# Altium schematic sheet USB_PowerOnly.SchDoc
size A2; SheetNumber: 2; SheetTotal: 14
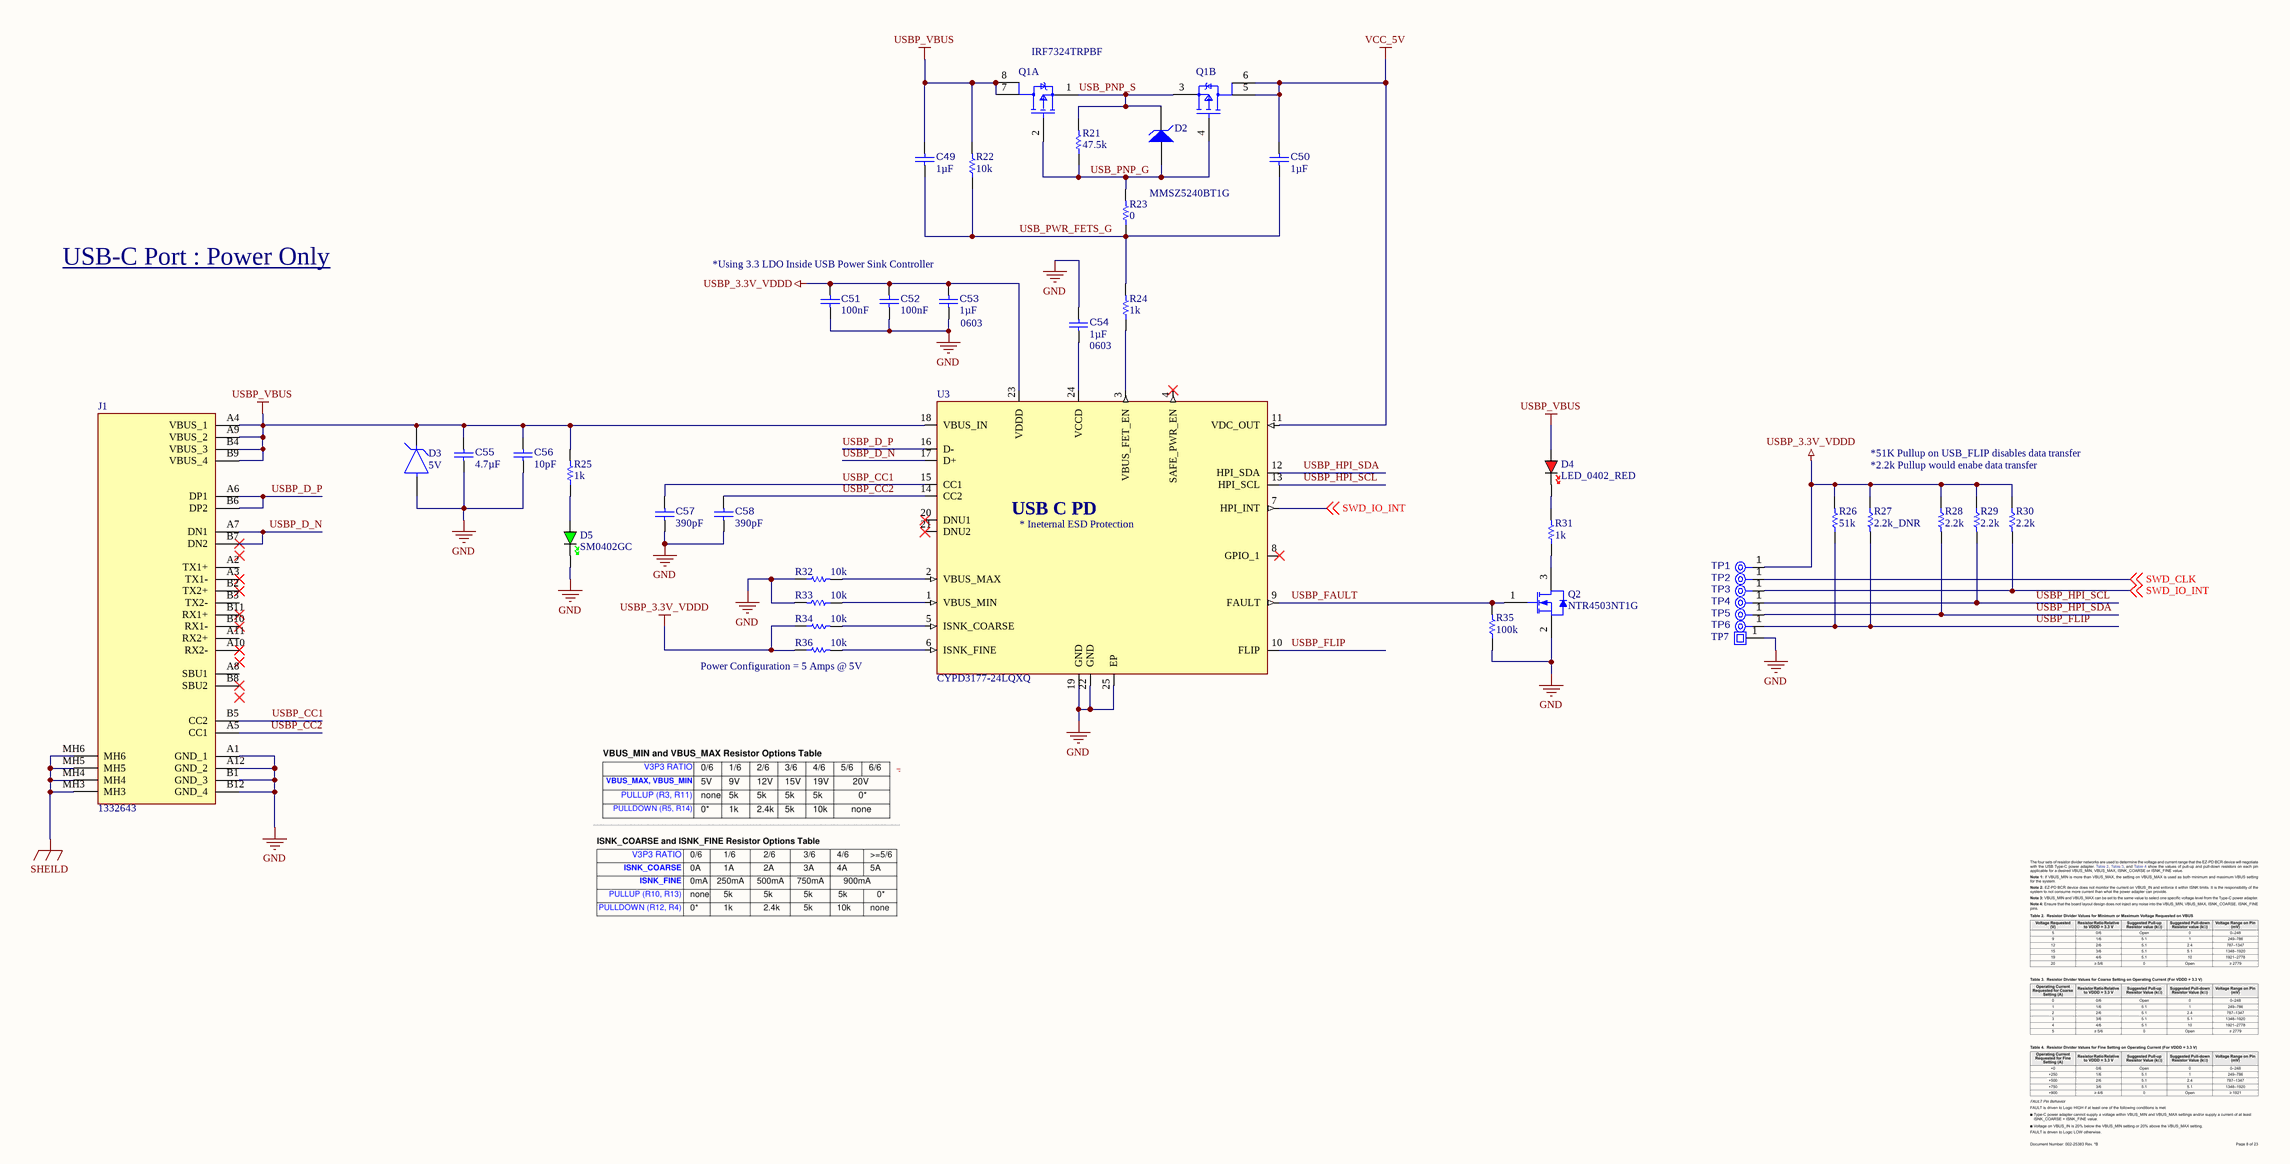
[diagram p0: USB_PowerOnly.SchDoc]

## Parts
C49  value 1µF  [CAPC2013X135X45NL10T25]  (hidden comment: Capacitor 1 uF +/- 10% 50 V 0805)
C50  value 1µF  [CAPC2013X135X45NL10T25]  (hidden comment: Capacitor 1 uF +/- 10% 50 V 0805)
C51  value 100nF  [CAPC2013X145X48ML20T23]  (hidden comment: VJ0805Y104JXXAT)
C52  value 100nF  [CAPC2013X145X48ML20T23]  (hidden comment: VJ0805Y104JXXAT)
C53  value 1µF  Case/Package: 0603  [CAPC1608X90X35LL15T15]  (hidden comment: 0603YC105JAT2A)
C54  value 1µF  Case/Package: 0603  [CAPC1608X90X35LL15T15]  (hidden comment: 0603YC105JAT2A)
C55  value 4.7µF  [CAPC0805(2012)145_L]  (hidden comment: Capacitor 4.7µF +/-40% 25V 0805)
C56  value 10pF  [CAPC1005X55X25ML05T05]  (hidden comment: Capacitor 10 pF +/- 5% 50 V 0402)
C57  value 390pF  [FP-C0402-BB-MFG]  (hidden comment: C0402C391K4RACTU)
C58  value 390pF  [FP-C0402-BB-MFG]  (hidden comment: C0402C391K4RACTU)
D2  MMSZ5240BT1G  [ONSC-SOD-123-2-425-04_V]
D3  Reverse Standoff Voltage: 5V  [FP-SMA-MFG]  (hidden comment: SMAJ5.0A-13-F)
D4  LED_0402_RED  [LED_0402_RED]
D5  SM0402GC  [FP-SM0402GC-MFG]
J1  1332643  [1332643]
Q1  IRF7324TRPBF  [FP-PG-DSO-8-IPC_B]  (parts A,B of 2)
Q2  NTR4503NT1G  [ONSC-SOT-23-3-318-08_V]
R21  value 47.5k  [RESC0402(1005)_L]  (hidden comment: Resistor 47K5 +/-1 % 0402 63 mW)
R22  value 10k  [RESC1005X40X25ML05T05]  (hidden comment: Resistor 10k +/-1% 0402 100 mW)
R23  value 0  [RESC1005X40X25ML05T05]  (hidden comment: Resistor 0R +/- 5% 0402 100 mW)
R24  value 1k  [RESC0402(1005)_L]  (hidden comment: Resistor 1K +/-5 % 0402 63 mW)
R25  value 1k  [RESC0402(1005)_L]  (hidden comment: Resistor 1K +/-5 % 0402 63 mW)
R26  value 51k  [RESC1005X40X25ML05T10]  (hidden comment: Resistor 51k +/-5% 0402 63 mW)
R27  value 2.2k_DNR  [RESC0402(1005)_L]  (hidden comment: Resistor 2K2  +/-5 % 0402 63 mW)
R28  value 2.2k  [RESC0402(1005)_L]  (hidden comment: Resistor 2K2  +/-5 % 0402 63 mW)
R29  value 2.2k  [RESC0402(1005)_L]  (hidden comment: Resistor 2K2  +/-5 % 0402 63 mW)
R30  value 2.2k  [RESC0402(1005)_L]  (hidden comment: Resistor 2K2  +/-5 % 0402 63 mW)
R31  value 1k  [RESC0402(1005)_L]  (hidden comment: Resistor 1K +/-5 % 0402 63 mW)
R32  value 10k  [RESC1005X40X25ML05T05]  (hidden comment: Resistor 10k +/-1% 0402 100 mW)
R33  value 10k  [RESC1005X40X25ML05T05]  (hidden comment: Resistor 10k +/-1% 0402 100 mW)
R34  value 10k  [RESC1005X40X25ML05T05]  (hidden comment: Resistor 10k +/-1% 0402 100 mW)
R35  value 100k  [RESC1005X40X25ML05T05]  (hidden comment: Resistor 100k +/-1% 0402 63 mW)
R36  value 10k  [RESC1005X40X25ML05T05]  (hidden comment: Resistor 10k +/-1% 0402 100 mW)
TP1  TPAD6R  [TP06R]  (value not drawn)  (no BOM)
TP2  TPAD6R  [TP06R]  (value not drawn)  (no BOM)
TP3  TPAD6R  [TP06R]  (value not drawn)  (no BOM)
TP4  TPAD6R  [TP06R]  (value not drawn)  (no BOM)
TP5  TPAD6R  [TP06R]  (value not drawn)  (no BOM)
TP6  TPAD6R  [TP06R]  (value not drawn)  (no BOM)
TP7  TestPoint_Ground_0.6mm  [TestPoint_Ground_0.6mm-Footprint-1]  (value not drawn)
U3  CYPD3177-24LQXQ  [QFN-24-0MM5]

## Nets
GND: C51.1 C52.1 C53.1 C54.1 C55.1 C56.1 C57.1 C58.1 D3.2(A) D5.K J1.A1(GND_1) J1.A12(GND_2) J1.B1(GND_3) J1.B12(GND_4) Q2.2(S) R32.1 R33.2 R35.1 U3.19(GND) U3.22(GND) U3.25(EP)
SHEILD: J1.MH3 J1.MH4 J1.MH5 J1.MH6
USBP_3.3V_VDDD: C51.2 C52.2 C53.2 R26.2 R27.1 R28.1 R29.1 R30.1 R34.1 R36.1 TP1.1(TP) U3.23(VDDD)
USBP_VBUS: C49.2 C55.2 C56.2 D3.1(C) D4.A J1.A4(VBUS_1) J1.A9(VBUS_2) J1.B4(VBUS_3) J1.B9(VBUS_4) Q1.7(D1) Q1.8(D1) R22.2 R25.2 U3.18(VBUS_IN)
VCC_5V: C50.2 Q1.5(D2) Q1.6(D2) U3.11(VDC_OUT)
SWD_CLK: TP2.1(TP) ; off-sheet SWD_CLK
SWD_IO_INT: R30.2 TP3.1(TP) U3.7(HPI_INT) ; off-sheet SWD_IO_INT
USB_PNP_G: D2.2(A) Q1.2(G1) Q1.4(G2) R21.1 R23.2
USB_PNP_S: D2.1(K) Q1.1(S1) Q1.3(S2) R21.2
USB_PWR_FETS_G: C49.1 C50.1 R22.1 R23.1 R24.2
USBP_CC1: C57.2 J1.B5(CC2) U3.15(CC1)
USBP_CC2: C58.2 J1.A5(CC1) U3.14(CC2)
USBP_D_N: J1.A7(DN1) J1.B7(DN2) U3.17(D+)
USBP_D_P: J1.A6(DP1) J1.B6(DP2) U3.16(D-)
USBP_FAULT: Q2.1(G) R35.2 U3.9(FAULT)
USBP_FLIP: R26.1 R27.2 TP6.1(TP) U3.10(FLIP)
USBP_HPI_SCL: R29.2 TP4.1(TP) U3.13(HPI_SCL)
USBP_HPI_SDA: R28.2 TP5.1(TP) U3.12(HPI_SDA)
NetC54_2: C54.2 U3.24(VCCD)
NetD4_K: D4.K R31.2
NetD5_A: D5.A R25.1
NetQ2_3: Q2.3(D) R31.1
NetR24_1: R24.1 U3.3(VBUS_FET_EN)
NetR32_2: R32.2 U3.2(VBUS_MAX)
NetR33_1: R33.1 U3.1(VBUS_MIN)
NetR34_2: R34.2 U3.5(ISNK_COARSE)
NetR36_2: R36.2 U3.6(ISNK_FINE)

Not connected (* = marked no-connect by the designer): J1 A2(TX1+) A3(TX1-)* A8(SBU1) A10(RX2-)* A11(RX2+) B2(TX2+)* B3(TX2-) B8(SBU2)* B10(RX1-)* B11(RX1+)*; TP7 1; U3 4(SAFE_PWR_EN)* 8(GPIO_1)* 20(DNU1)* 21(DNU2)*

## Notes on the sheet
- USB-C Port : Power Only
- *Using 3.3 LDO Inside USB Power Sink Controller
- *51K Pullup on USB_FLIP disables data transfer
- *2.2k Pullup would enabe data transfer
- (near R36) Power Configuration = 5 Amps @ 5V
- (in symbol CMP-049-000093-2) USB C PD; * Ineternal ESD Protection

## Library data of the parts
C49 C50 = CMP-001-00007-7: Chip Capacitor, 1 uF, +/- 10%, 50 V, 0805 (2012 Metric); Voltage Rating: 50V; Capacitor Type: Ceramic; Tolerance: 10%; Case/Package: 0805; RoHS Compliant: True; Min Operating Temperature: -55°C; Max Operating Temperature: 125°C; Mounting Technology: SM; Pins: 2
C51 C52 = CMP-001-00087-1: Ceramic Capacitor, Multilayer, Ceramic, 25V, 5% +Tol, 5% -Tol, X7R, 15% TC, 0.1uF, Surface Mount, 0805; Min Operating Temperature: -55°C; Case/Package: 0805; Max Operating Temperature: 125°C; Capacitor Type: Ceramic; Mounting Technology: Surface Mount; Pins: 2; RoHS Compliant: Yes
C53 C54 = CMP-001-00114-1: 0603 1 uF 16 V ±5 % Tolerance X7R Surface Mount Multilayer Ceramic Capacitor; Tolerance: 5%; Voltage Rating: 16V; Min Operating Temperature: -55°C; Max Operating Temperature: 125°C; Mounting Technology: Surface Mount
C55 = CMP-001-00080-5: Chip Capacitor, 4.7µF +/-40%, 25V, 0805, Thickness 1.45 mm; Tolerance: 20%; Max Operating Temperature: 85°C; Voltage Rating: 25V; Mounting Technology: SMT; Case/Package: 0805; Pins: 2; Min Operating Temperature: -55°C
C56 = CMP-001-00013-7: Chip Capacitor, 10 pF, +/- 5%, 50 V, 0402 (1005 Metric); Voltage Rating: 50V; Capacitor Type: Ceramic; Case/Package: 0402; Pins: 2; Tolerance: 5%; Max Operating Temperature: 125°C; RoHS Compliant: True; Mounting Technology: SM; Min Operating Temperature: -55°C
C57 C58 = CMP-001-00118-1: Multilayer Ceramic Capacitors MLCC - SMD/SMT 16V 390pF X7R 0402 10%; Max Operating Temperature: 125°C; Voltage Rating: 16V; Tolerance: 10%; Pins: 2; Case/Package: 0402; Min Operating Temperature: -55°C; Mounting Technology: Surface Mount
D2 = CMP-1060-00549-1: Zener Voltage Regulator, 500 mW, 2-Pin SOD-123, Pb-Free, Tape and Reel; Manufacturer: On Semiconductor; P Max (W): 0.5; VZ Typ (V): 10; PackageVersion: Rev. G, 10/2009; ComponentLink2Description: Datasheet; RoHS: Pb-Free; ComponentLink2URL: http://www.onsemi.com/pub_link/Collateral/MMSZ5221BT1-D.PDF; PackageReference: SOD-123-2-425-04; ComponentLink1URL: http://www.onsemi.com/; ComponentLink3Description: Package Specification; ComponentLink1Description: Manufacturer URL; Packing: Tape and Reel; Mounting Technology: Surface Mount; ComponentLink3URL: http://www.onsemi.com/pub_link/Collateral/425-04.PDF; PackageDescription: 2-Pin SOD, Body 1.6 x 2.69 mm; PartNumber: MMSZ5240BT1G; DatasheetVersion: Rev. 12
D3 = CMP-004-00031-1: TVS DIODE 5V 9.2V SMA; Manufacturer: Diodes Inc.; Peak Pulse Current: 43.5A; Direction: Unidirectional; Standoff Height: 0.05mm; Max Junction Temp: +150°C; Breakdown Voltage: 6.4V; Peak Pulse Power: 400W; Number Of Channels: 1; Pins: 2; Device Class L3: unset; Device Class L1: Circuit Protection; Category: Diode; Manufacturer Part Number: SMAJ5.0A-13-F; Footprint Url: https://www.diodes.com/assets/Package-Files/SMA.pdf; Case/Package: SMA; Source: CodyStates.SchLib; Component Type: Standard; Temperature: -55°C to +150°C; Temperature Range High: 150°C; Automotive: No; Mouser Description: TVS DIODE 5V 9.2V SMA; Octopart: https://octopart.com/smaj5.0a-13-f-diodes+inc.-350158; Lead Free: Yes; Device Class L2: TVS Diodes; RoHS: TRUE; Clamping Voltage: 9.2V; Height: 2.4mm; Temperature Range Low: -55°C; Design Item ID: SMAJ5.0A-13-F; Digikey Description: TVS DIODE 5V 9.2V SMA
D4 = CMP-004-00045-1: LED 0402 RED SMD; Source: Schematic-Lib-PhilsLab.SchLib; Design Item ID: LED_0402_RED
D5 = CMP-007-00038-1: LED Uni-Color Green 575nm 2-PinChip 0402(1006Metric) T/R; Forward Voltage: 2.6V; Forward Current: 30mA; Min Operating Temperature: -30°C; Case/Package: 0402; Max Operating Temperature: 80°C; Mounting Technology: Surface Mount
J1 = CMP-002-00162-2: USB-C connector. Horizontal layout. 5A amp rated.; Manufacturer_Name: Phoenix Contact; Mouser Part Number: 651-1332643; Manufacturer_Part_Number: 1332643; Height: 3.31mm; Arrow Part Number: 1332643; Mouser Price/Stock: https://www.mouser.co.uk/ProductDetail/Phoenix-Contact/1332643?qs=Znm5pLBrcAJhPoOCsTWMGg%3D%3D; Design Item ID: 1332643; Datasheet Link: http://www.phoenixcontact.com/de/produkte/1332643; Arrow Price/Stock: https://www.arrow.com/en/products/1332643/phoenix-contact?utm_currency=USD&region=nac; Source: SamacSys.SchLib
Q1 = CMP-32901-000434-1: MOSFET 2P-CH 20V 9A 8-SOIC; Drain to Source Breakdown Voltage: -20V; Turn-Off Delay Time: 170ns; Max Power Dissipation: 2W; Threshold Voltage: -1V; Drain to Source Resistance: 26mR; Rds On Max: 18mR; Gate to Source Voltage (Vgs): 12V; Turn-On Delay Time: 17ns; Input Capacitance: 2.94nF; Number of Pins: 8; Width: 0.157inch; Lead Free: Lead Free; REACH SVHC: No SVHC; Halogen Free: Halogen Free; Mount: Surface Mount; Length: 0.196inch; Continuous Drain Current (ID): 9A; Drain to Source Voltage (Vdss): -20V; Height: 0.059inch; RoHS Compliant: Yes; Max Dual Supply Voltage: -20V; Power Dissipation: 2W; Case/Package: SO; Packaging: Tape and Reel; Max Operating Temperature: 150°C; Min Operating Temperature: -55°C
Q2 = CMP-1058-00742-1: Power MOSFET, 30 V, 2.5 A, Single N-Channel, 3-Pin SOT-23, Pb-Free, Tape and Reel; Manufacturer: On Semiconductor; Qrr Typ (nC): 4; ID Max (A): 2.5; VGS(th) Max (V): 3; VGS Max (V): 20; Channel Polarity: N Channel; V(BR)DSS Min (V): 30; ComponentLink3URL: http://www.onsemi.cn/pub_link/Collateral/318-08.PDF; PackageReference: SOT-23-3-318-08; ComponentLink2URL: http://www.onsemi.cn/pub_link/Collateral/NTR4503N-D.PDF; ComponentLink2Description: Datasheet; ComponentLink1Description: Manufacturer URL; Configuration: Single; ComponentLink1URL: http://www.onsemi.com/; PackageVersion: Rev. AP, 11/2009; Package Type: SOT-23-3; DatasheetVersion: Rev. 6; ComponentLink3Description: Package Specification; PartNumber: NTR4503NT1G; Packing: Tape and Reel; RoHS: Pb-Free; Mounting Technology: Surface Mount; PackageDescription: 3-Pin Small Outline Transistor, Body 2.92 x 1.3 mm, Pitch 0.95 mm
R21 = CMP-009-00137-4: Chip Resistor, 47,5 kOhms, +/-1 %, 63 mW, -55 to 155 degC, 0402; Tolerance: 1%; Power: 63mW; Pins: 2; Case/Package: 0402; Min Operating Temperature: -55°C; Max Operating Temperature: 155°C
R22 R32-R34 R36 = CMP-009-00015-6: Chip Resistor, 10 KOhm, +/- 1%, 0.1 W, -55 to 155 degC, 0402 (1005 Metric); Voltage Rating: 50V; Power: 100mW; Max Operating Temperature: 155°C; Case/Package: 0402; Tolerance: 1%; Min Operating Temperature: -55°C; Pins: 2; Mounting Technology: SM; RoHS Compliant: True
R23 = CMP-009-00005-6: Chip Resistor, 0 Ohm, 0.1 W, -55 to 155 degC, 0402 (1005 Metric); Voltage Rating: 50V; Power: 100mW; Case/Package: 0402; Min Operating Temperature: -55°C; Mounting Technology: SM; Pins: 2; Tolerance: 5%; Max Operating Temperature: 155°C; RoHS Compliant: True
R24 R25 R31 = CMP-009-00157-4: Chip Resistor, 1 kOhms, +/-5 %, 63 mW, -55 to 155 degC, 0402; Tolerance: 5%; Power: 63mW; Pins: 2; Max Operating Temperature: 155°C; Min Operating Temperature: -55°C; Case/Package: 0402
R26 = CMP-009-00000-6: Chip Resistor, 51 KOhm, +/- 5%, 0.063 W, -55 to 155 degC, 0402 (1005 Metric); Power: 63mW; Tolerance: 5%; Pins: 2; RoHS Compliant: True; Max Operating Temperature: 155°C; Mounting Technology: SM; Min Operating Temperature: -55°C; Case/Package: 0402
R27-R30 = CMP-009-00166-4: Chip Resistor, 2,2 kOhms, +/-5 %, 63 mW, -55 to 155 degC, 0402; Power: 63mW; Tolerance: 5%; Max Operating Temperature: 155°C; Pins: 2; Case/Package: 0402; Min Operating Temperature: -55°C
R35 = CMP-009-00021-6: Chip Resistor, 100 KOhm, +/- 1%, 0.063 W, -55 to 155 degC, 0402 (1005 Metric); Power: 63mW; Voltage Rating: 50V; Case/Package: 0402; RoHS Compliant: True; Max Operating Temperature: 155°C; Mounting Technology: SM; Tolerance: 1%; Min Operating Temperature: -55°C; Pins: 2
TP1-TP6 = CMP-00028-00002-2: 0.6mm round; Pins: 1
TP7 = CMP-00030-00005-1: A 0.6mm square test point that is specifically designed to be a ground connection and stand out from the other signals.
U3 = CMP-049-000093-2: USB Type-C Port Controller for Power Sinks; Manufacturer: Cypress Semicon; Distributor Link: https://www.lcsc.com/product-detail/USB-ICs_Cypress-Semicon-CYPD3177-24LQXQ_C2959321.html; Design Item ID: CYPD3177-24LQXQ; Manufacturer Part Number: CYPD3177-24LQXQ